# EAGLE schematic Circuit (EAGLE 9.5.2)
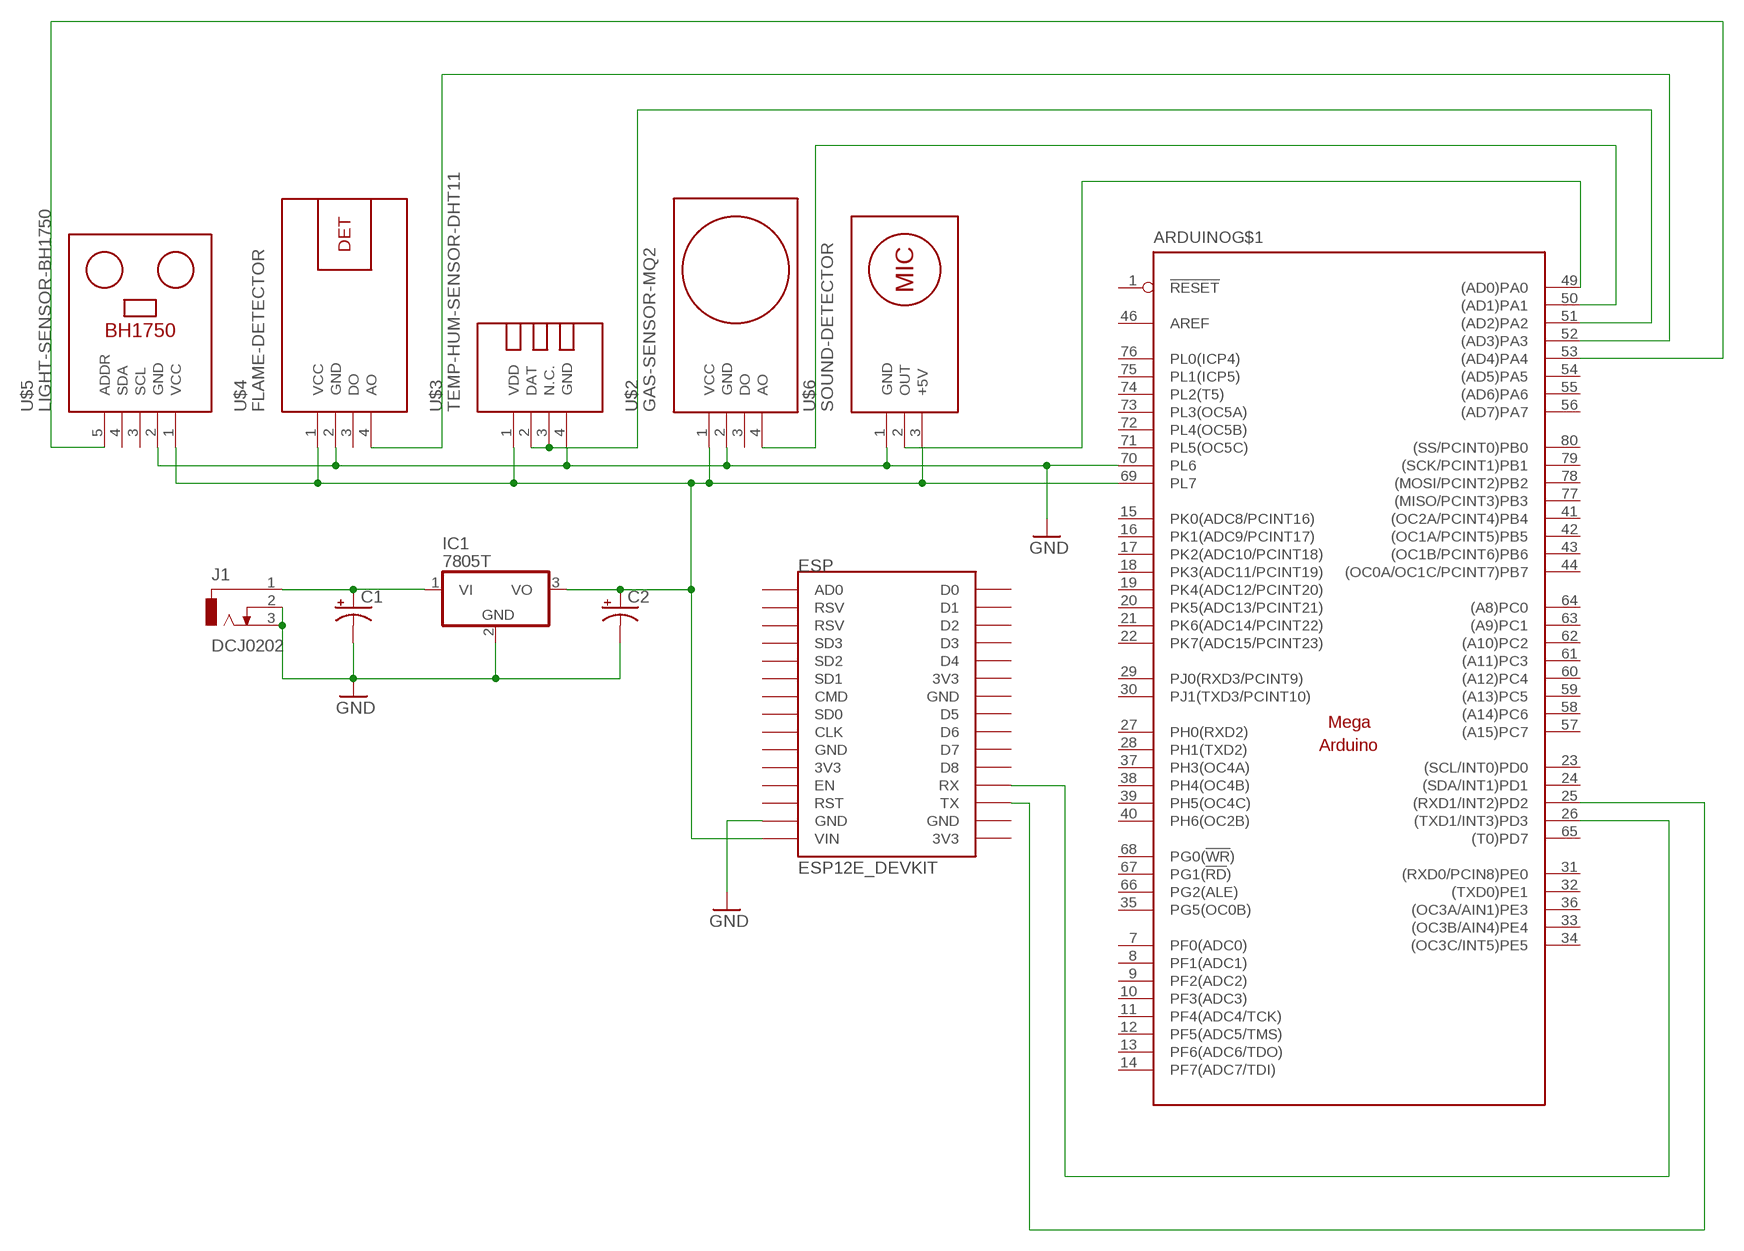
[diagram p0: schematic, sheet 1]

## Parts
ARDUINO  MEGAARDUINO_22  [MEGA_ARDUINO_2]
C1  CPOL-USTAP5-45  [TAP5-45]
C2  CPOL-USTAP5-45  [TAP5-45]
ESP  ESP12E_DEVKIT  [ESP12E_DEVKIT]
IC1  7805T  [TO220H]
J1  DCJ0202  [DCJ0202]
U$2  GAS-SENSOR-MQ2  [GAS-SENSOR-MQ2]
U$3  TEMP-HUM-SENSOR-DHT11  [TEMP-HUM-SENSOR-DHT11]
U$4  FLAME-DETECTOR  [FLAME-DETECTOR]
U$5  LIGHT-SENSOR-BH1750  [LIGHT-SENSOR-BH1750]
U$6  SOUND-DETECTOR  [SOUND-DETECTOR]

## Nets
GND: ARDUINO.70(PL6) C1.- C2.- ESP.GND@1(GND) IC1.2(GND) J1.2 J1.3 U$2.2(GND) U$3.4(GND) U$4.2(GND) U$5.2(GND) U$6.1(GND)
N$1: ARDUINO.52((AD3)PA3) U$4.4(AO)
N$2: C1.+ IC1.1(VI) J1.1
N$3: ARDUINO.69(PL7) C2.+ ESP.VIN IC1.3(VO) U$2.1(VCC) U$3.1(VDD) U$4.1(VCC) U$5.1(VCC) U$6.3(+5V)
N$4: ARDUINO.53((AD4)PA4) U$5.5(ADDR)
N$5: ARDUINO.26((TXD1/INT3)PD3) ESP.RX
N$6: ARDUINO.49((AD0)PA0) U$6.2(OUT)
N$7: ARDUINO.50((AD1)PA1) U$2.4(AO)
N$8: ARDUINO.51((AD2)PA2) U$3.2(DAT) U$3.3(N.C.)
N$9: ARDUINO.25((RXD1/INT2)PD2) ESP.TX
Unconnected: ARDUINO.1(!RESET) ARDUINO.7(PF0(ADC0)) ARDUINO.8(PF1(ADC1)) ARDUINO.9(PF2(ADC2)) ARDUINO.10(PF3(ADC3)) ARDUINO.11(PF4(ADC4/TCK)) ARDUINO.12(PF5(ADC5/TMS)) ARDUINO.13(PF6(ADC6/TDO)) ARDUINO.14(PF7(ADC7/TDI)) ARDUINO.15(PK0(ADC8/PCINT16)) ARDUINO.16(PK1(ADC9/PCINT17)) ARDUINO.17(PK2(ADC10/PCINT18)) ARDUINO.18(PK3(ADC11/PCINT19)) ARDUINO.19(PK4(ADC12/PCINT20)) ARDUINO.20(PK5(ADC13/PCINT21)) ARDUINO.21(PK6(ADC14/PCINT22)) ARDUINO.22(PK7(ADC15/PCINT23)) ARDUINO.23((SCL/INT0)PD0) ARDUINO.24((SDA/INT1)PD1) ARDUINO.27(PH0(RXD2)) ARDUINO.28(PH1(TXD2)) ARDUINO.29(PJ0(RXD3/PCINT9)) ARDUINO.30(PJ1(TXD3/PCINT10)) ARDUINO.31((RXD0/PCIN8)PE0) ARDUINO.32((TXD0)PE1) ARDUINO.33((OC3B/AIN4)PE4) ARDUINO.34((OC3C/INT5)PE5) ARDUINO.35(PG5(OC0B)) ARDUINO.36((OC3A/AIN1)PE3) ARDUINO.37(PH3(OC4A)) ARDUINO.38(PH4(OC4B)) ARDUINO.39(PH5(OC4C)) ARDUINO.40(PH6(OC2B)) ARDUINO.41((OC2A/PCINT4)PB4) ARDUINO.42((OC1A/PCINT5)PB5) ARDUINO.43((OC1B/PCINT6)PB6) ARDUINO.44((OC0A/OC1C/PCINT7)PB7) ARDUINO.46(AREF) ARDUINO.54((AD5)PA5) ARDUINO.55((AD6)PA6) ARDUINO.56((AD7)PA7) ARDUINO.57((A15)PC7) ARDUINO.58((A14)PC6) ARDUINO.59((A13)PC5) ARDUINO.60((A12)PC4) ARDUINO.61((A11)PC3) ARDUINO.62((A10)PC2) ARDUINO.63((A9)PC1) ARDUINO.64((A8)PC0) ARDUINO.65((T0)PD7) ARDUINO.66(PG2(ALE)) ARDUINO.67(PG1(!RD!)) ARDUINO.68(PG0(!WR!)) ARDUINO.71(PL5(OC5C)) ARDUINO.72(PL4(OC5B)) ARDUINO.73(PL3(OC5A)) ARDUINO.74(PL2(T5)) ARDUINO.75(PL1(ICP5)) ARDUINO.76(PL0(ICP4)) ARDUINO.77((MISO/PCINT3)PB3) ARDUINO.78((MOSI/PCINT2)PB2) ARDUINO.79((SCK/PCINT1)PB1) ARDUINO.80((SS/PCINT0)PB0) ESP.3V3@0(3V3) ESP.3V3@1(3V3) ESP.3V3@2(3V3) ESP.AD0 ESP.CLK ESP.CMD ESP.D0 ESP.D1 ESP.D2 ESP.D3 ESP.D4 ESP.D5 ESP.D6 ESP.D7 ESP.D8 ESP.EN ESP.GND@0(GND) ESP.GND@2(GND) ESP.GND@3(GND) ESP.RST ESP.RSV@0(RSV) ESP.RSV@1(RSV) ESP.SD0 ESP.SD1 ESP.SD2 ESP.SD3 U$2.3(DO) U$4.3(DO) U$5.3(SCL) U$5.4(SDA)

## Power pins joined to a net without a drawn wire
+3V3: ARDUINO.2(+3V3)
+5V: ARDUINO.3(+5V) ARDUINO.47(+5V) ARDUINO.48(+5V)
+VIN: ARDUINO.6(+VIN)
GND: ARDUINO.4(GND) ARDUINO.5(GND) ARDUINO.45(GND) ARDUINO.81(GND) ARDUINO.82(GND)

## Library data of the parts
ARDUINO = arduino:MEGAARDUINO_2: The Arduino Mega is a microcontroller board based on the ATmega1280. - 54 digital input/output pins (of which 14 can be used as PWM outputs) - 16 analog inputs - 4 UARTs (hardware serial ports) - 16 MHz crystal oscillator - USB connection - power jack - ICSP header - reset button It contains everything needed to support the microcontroller; simply connect it to a computer with a USB cable or power it with a AC-to-DC adapter or battery to get started. The Mega is compatible with most shields designed for the Arduino Duemilanove or Diecimila. http://arduino.cc/en/Main/ArduinoBoardMega
C1 C2 = rcl:CPOL-US: POLARIZED CAPACITOR, American symbol; SPICEPREFIX: C
ESP = ESP12E_DEVKIT:ESP12E_DEVKIT: ESP12E DEVKIT BOARD
IC1 = linear:78*: Positive VOLTAGE REGULATOR Source: http://cache.national.com/ds/LM/LM78L05.pdf http://www.fairchildsemi.com/ds/LM/LM7805.pdf
J1 = con-jack:DCJ0202: DC POWER JACK Source: DCJ0202.pdf; OC_FARNELL: unknown; OC_NEWARK: unknown
U$2 = diy-modules:GAS-SENSOR-MQ2: Gas Sensor based on MQ-2 device Guide describing how to use MQ-2 sensor with Arduino is available here: http://www.instructables.com/id/How-to-use-MQ2-Gas-Sensor-Arduino-Tutorial/ MQ-2 sensor datasheet is available here: http://gas-sensor.ru/pdf/combustible-gas-sensor.pdf Click here to find device on ebay.com <http://www.ebay.com/sch/mq2+sensor+module+smoke>
U$3 = diy-modules:TEMP-HUM-SENSOR-DHT11: DHT11 - digital humidity & temperature sensor DHT11 datasheet available here: https://akizukidenshi.com/download/ds/aosong/DHT11.pdf Click here to find device on ebay.com <http://www.ebay.com/sch/dht11+digital+sensor>
U$4 = diy-modules:FLAME-DETECTOR: Flame Detector Click here to find device on ebay.com <http://www.ebay.com/sch/flame+detector+arduino>
U$5 = diy-modules:LIGHT-SENSOR-BH1750: Digital Light Sensor based on BH1750 BH1750 datasheet is available here: http://www.mouser.com/ds/2/348/bh1750fvi-e-186247.pdf Arduino Library for BH1750 is available here: https://github.com/claws/BH1750 Video Tutorial is available here: https://www.youtube.com/watch?v=UsLcHSbxf_8 Click here to find device on ebay.com <http://www.ebay.com/sch/bh1750fvi+module> Note: There are many variants. Search for the proper version.
U$6 = diy-modules:SOUND-DETECTOR: Sound Detection Module